# Altium project QCopterFC.PrjPCB
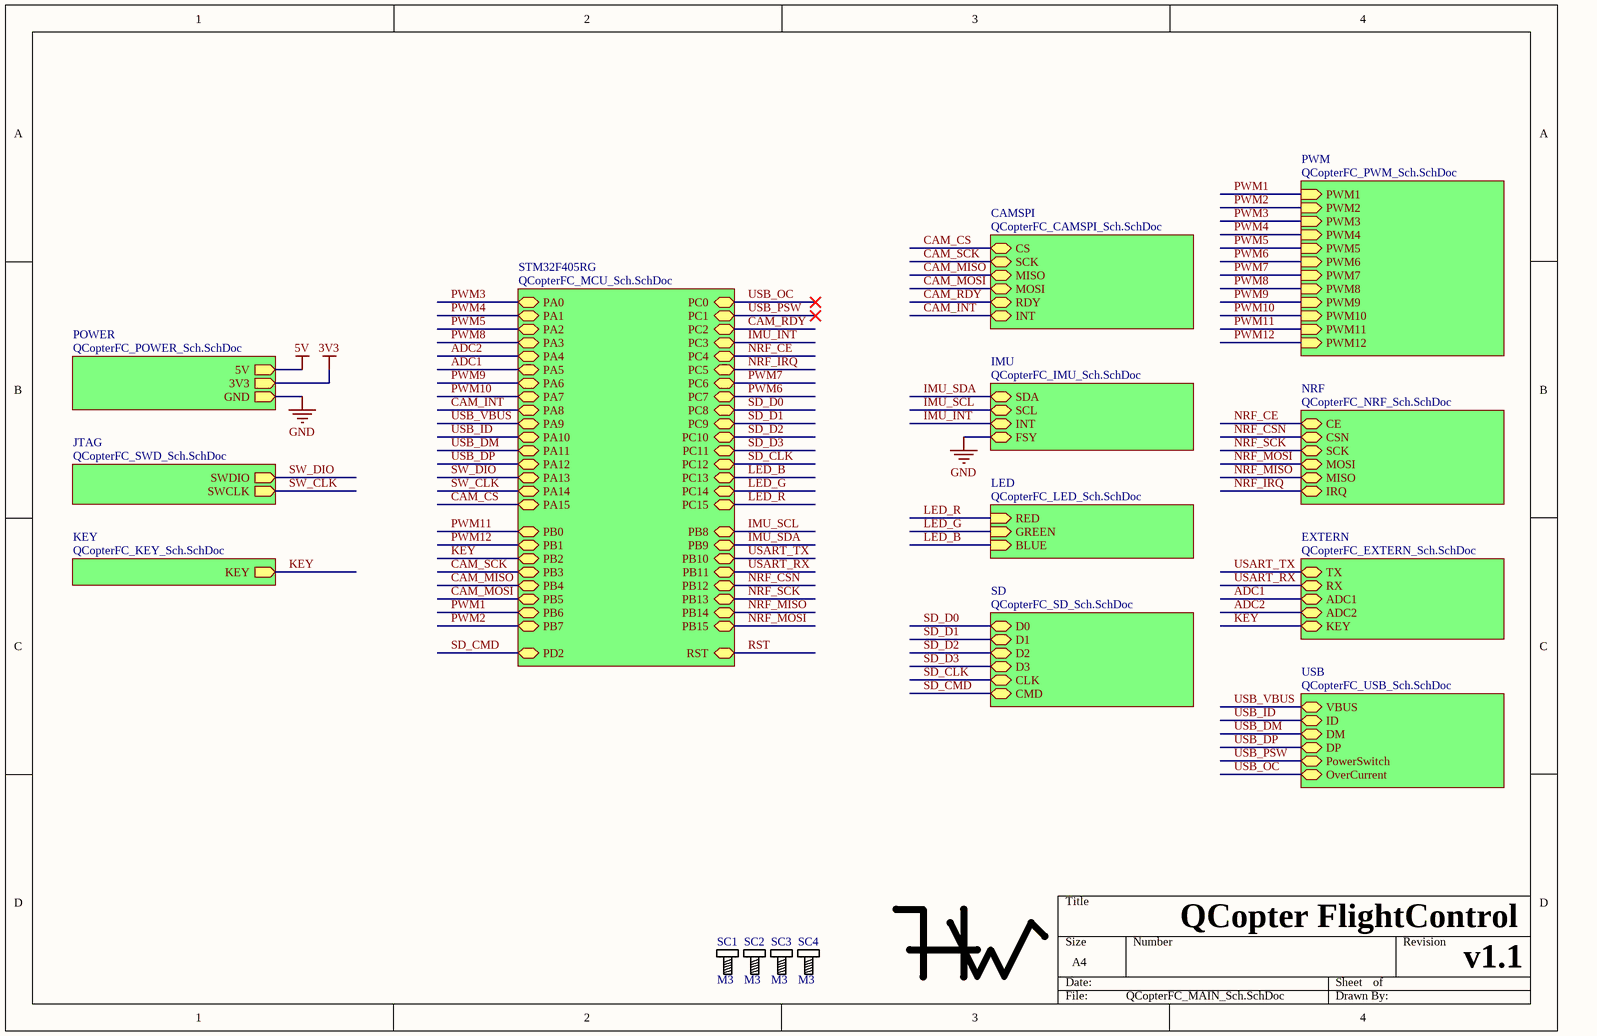
[diagram p0: QCopterFC_MAIN_Sch.SchDoc]
10 sheets, 47 parts. Net scope: hierarchical (ports join the sheet entries above them; power ports are global).
Board file: QCopterFC__Pcb.PcbDoc
Sheets:
  QCopterFC_MAIN_Sch.SchDoc
    CAMSPI = QCopterFC_CAMSPI_Sch.SchDoc
    NRF = QCopterFC_NRF_Sch.SchDoc
    JTAG = QCopterFC_SWD_Sch.SchDoc
    KEY = QCopterFC_KEY_Sch.SchDoc
    PWM = QCopterFC_PWM_Sch.SchDoc
    STM32F405RG = QCopterFC_MCU_Sch.SchDoc
    SD = QCopterFC_SD_Sch.SchDoc
    EXTERN = QCopterFC_EXTERN_Sch.SchDoc
    USB = QCopterFC_USB_Sch.SchDoc

## Sheet QCopterFC_MAIN_Sch.SchDoc
size A4

### Parts
Mark1  Mark  [HW_Mark]  (value not drawn)
SC1  M3  [SCRREW_M3]
SC2  M3  [SCRREW_M3]
SC3  M3  [SCRREW_M3]
SC4  M3  [SCRREW_M3]

### Sub-sheets
CAMSPI = QCopterFC_CAMSPI_Sch.SchDoc: MISO, CS, MOSI, SCK, RDY, INT
EXTERN = QCopterFC_EXTERN_Sch.SchDoc: ADC1, ADC2, TX, RX, KEY
IMU = QCopterFC_IMU_Sch.SchDoc (file not in this document): SCL, SDA, FSY, INT
JTAG = QCopterFC_SWD_Sch.SchDoc: SWDIO (out), SWCLK (out)
KEY = QCopterFC_KEY_Sch.SchDoc: KEY (out)
LED = QCopterFC_LED_Sch.SchDoc (file not in this document): RED (in), GREEN (in), BLUE (in)
NRF = QCopterFC_NRF_Sch.SchDoc: MISO, MOSI, SCK, CSN, CE, IRQ
POWER = QCopterFC_POWER_Sch.SchDoc (file not in this document): 3V3 (out), 5V (out), GND (out)
PWM = QCopterFC_PWM_Sch.SchDoc: PWM1 (in), PWM2 (in), PWM3 (in), PWM4 (in), PWM5 (in), PWM6 (in), PWM7 (in), PWM8 (in), PWM9 (in), PWM10 (in), PWM11 (in), PWM12 (in)
SD = QCopterFC_SD_Sch.SchDoc: D0, CLK, CMD, D1, D2, D3
STM32F405RG = QCopterFC_MCU_Sch.SchDoc: PA0, PA1, PA2, PA3, PA4, PA5, PA6, PA7, PA8, PA9, PA10, PA11, PA12, PA13, PA14, PA15, PB0, PB1, PB2, PB3, PB4, PB5, PB6, PB7, PB8, PB9, PB10, PB11, PB12, PB13, PB14, PB15, PC0, PC1, PC2, PC3, PC4, PC5, PC6, PC7, PC8, PC9, PC10, PC11, PC12, PC13, PC14, PC15, PD2, RST
USB = QCopterFC_USB_Sch.SchDoc: VBUS, ID, DM, DP, PowerSwitch, OverCurrent

### Nets
5V: sheet POWER/5V
GND: sheet IMU/FSY, sheet POWER/GND
ADC1: sheet STM32F405RG/PA5, sheet EXTERN/ADC1
ADC2: sheet STM32F405RG/PA4, sheet EXTERN/ADC2
CAM_CS: sheet CAMSPI/CS, sheet STM32F405RG/PA15
CAM_INT: sheet CAMSPI/INT, sheet STM32F405RG/PA8
CAM_MISO: sheet CAMSPI/MISO, sheet STM32F405RG/PB4
CAM_MOSI: sheet CAMSPI/MOSI, sheet STM32F405RG/PB5
CAM_RDY: sheet CAMSPI/RDY, sheet STM32F405RG/PC2
CAM_SCK: sheet CAMSPI/SCK, sheet STM32F405RG/PB3
IMU_INT: sheet IMU/INT, sheet STM32F405RG/PC3
IMU_SCL: sheet IMU/SCL, sheet STM32F405RG/PB8
IMU_SDA: sheet IMU/SDA, sheet STM32F405RG/PB9
KEY: sheet KEY/KEY, sheet STM32F405RG/PB2, sheet EXTERN/KEY
LED_B: sheet LED/BLUE, sheet STM32F405RG/PC13
LED_G: sheet LED/GREEN, sheet STM32F405RG/PC14
LED_R: sheet LED/RED, sheet STM32F405RG/PC15
NRF_CE: sheet NRF/CE, sheet STM32F405RG/PC4
NRF_CSN: sheet NRF/CSN, sheet STM32F405RG/PB12
NRF_IRQ: sheet NRF/IRQ, sheet STM32F405RG/PC5
NRF_MISO: sheet NRF/MISO, sheet STM32F405RG/PB14
NRF_MOSI: sheet NRF/MOSI, sheet STM32F405RG/PB15
NRF_SCK: sheet NRF/SCK, sheet STM32F405RG/PB13
PWM1: sheet PWM/PWM1, sheet STM32F405RG/PB6
PWM2: sheet PWM/PWM2, sheet STM32F405RG/PB7
PWM3: sheet PWM/PWM3, sheet STM32F405RG/PA0
PWM4: sheet PWM/PWM4, sheet STM32F405RG/PA1
PWM5: sheet PWM/PWM5, sheet STM32F405RG/PA2
PWM6: sheet PWM/PWM6, sheet STM32F405RG/PC7
PWM7: sheet PWM/PWM7, sheet STM32F405RG/PC6
PWM8: sheet PWM/PWM8, sheet STM32F405RG/PA3
PWM9: sheet PWM/PWM9, sheet STM32F405RG/PA6
PWM10: sheet PWM/PWM10, sheet STM32F405RG/PA7
PWM11: sheet PWM/PWM11, sheet STM32F405RG/PB0
PWM12: sheet PWM/PWM12, sheet STM32F405RG/PB1
SD_CLK: sheet STM32F405RG/PC12, sheet SD/CLK
SD_CMD: sheet STM32F405RG/PD2, sheet SD/CMD
SD_D0: sheet STM32F405RG/PC8, sheet SD/D0
SD_D1: sheet STM32F405RG/PC9, sheet SD/D1
SD_D2: sheet STM32F405RG/PC10, sheet SD/D2
SD_D3: sheet STM32F405RG/PC11, sheet SD/D3
SW_CLK: sheet JTAG/SWCLK, sheet STM32F405RG/PA14
SW_DIO: sheet JTAG/SWDIO, sheet STM32F405RG/PA13
USART_RX: sheet STM32F405RG/PB11, sheet EXTERN/RX
USART_TX: sheet STM32F405RG/PB10, sheet EXTERN/TX
USB_DM: sheet STM32F405RG/PA11, sheet USB/DM
USB_DP: sheet STM32F405RG/PA12, sheet USB/DP
USB_ID: sheet STM32F405RG/PA10, sheet USB/ID
USB_OC: sheet STM32F405RG/PC0, sheet USB/OverCurrent
USB_PSW: sheet STM32F405RG/PC1, sheet USB/PowerSwitch
USB_VBUS: sheet STM32F405RG/PA9, sheet USB/VBUS

### Notes on the sheet
- QCopter FlightControl
- v1.1

### Library data of the parts
Mark1 = HW
SC1-SC4 = Screw_M3: Screw

## Sheet QCopterFC_CAMSPI_Sch.SchDoc
size A4
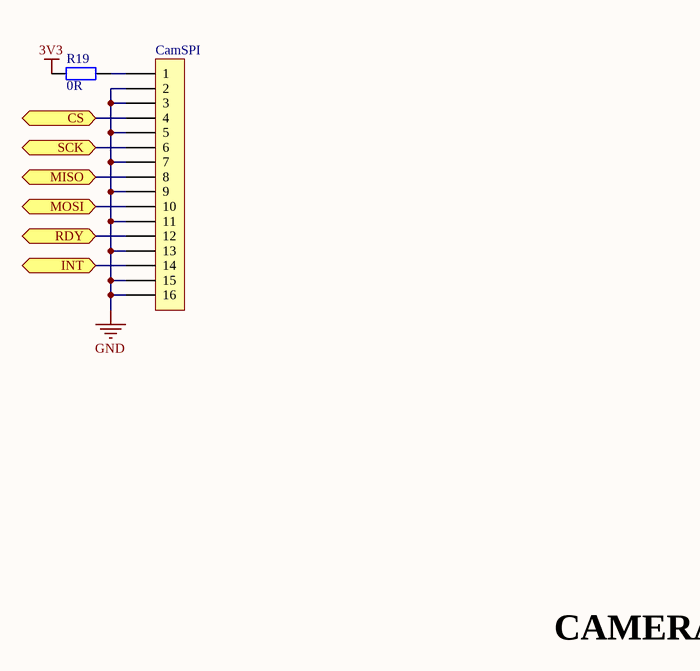
[diagram p1: QCopterFC_CAMSPI_Sch.SchDoc]

### Parts
CamSPI  FFC_0.5_16  [FFC_0.5_16]  (value not drawn)
R19  value 0R  [RES_0603]  (hidden comment: Res_0603)

### Ports
CS, INT, MISO, MOSI, RDY, SCK

### Nets
3V3: R19.1
GND: CamSPI.2 CamSPI.3 CamSPI.5 CamSPI.7 CamSPI.9 CamSPI.11 CamSPI.13 CamSPI.15 CamSPI.16
CAM_CS: CamSPI.4 ; port CS
CAM_INT: CamSPI.14 ; port INT
CAM_MISO: CamSPI.8 ; port MISO
CAM_MOSI: CamSPI.10 ; port MOSI
CAM_RDY: CamSPI.12 ; port RDY
CAM_SCK: CamSPI.6 ; port SCK
NetCamSPI_1: CamSPI.1 R19.2

### Notes on the sheet
- CAMERA

### Library data of the parts
CamSPI = FFC_0.5_16: FFC
R19 = Res_0603: Resistor

## Sheet QCopterFC_NRF_Sch.SchDoc
size A4
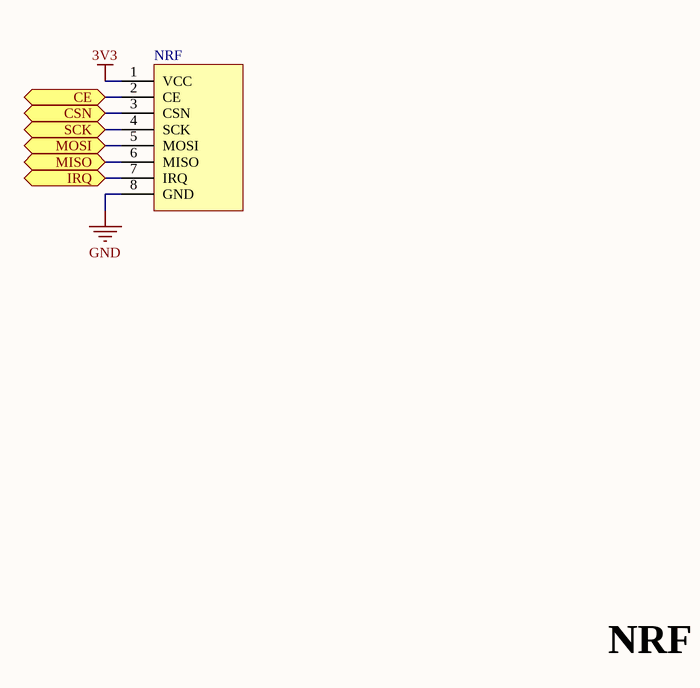
[diagram p2: QCopterFC_NRF_Sch.SchDoc]

### Parts
NRF  nRF24L01P_PA_LNA  [NRF24L01P_PA_LNA]  (value not drawn)

### Ports
CE, CSN, IRQ, MISO, MOSI, SCK

### Nets
3V3: NRF.1(VCC)
GND: NRF.8(GND)
NRF_CE: NRF.2(CE) ; port CE
NRF_CSN: NRF.3(CSN) ; port CSN
NRF_IRQ: NRF.7(IRQ) ; port IRQ
NRF_MISO: NRF.6(MISO) ; port MISO
NRF_MOSI: NRF.5(MOSI) ; port MOSI
NRF_SCK: NRF.4(SCK) ; port SCK

### Notes on the sheet
- NRF

### Library data of the parts
NRF = nRF24L01P_PA_LNA: Module

## Sheet QCopterFC_SWD_Sch.SchDoc
size A4
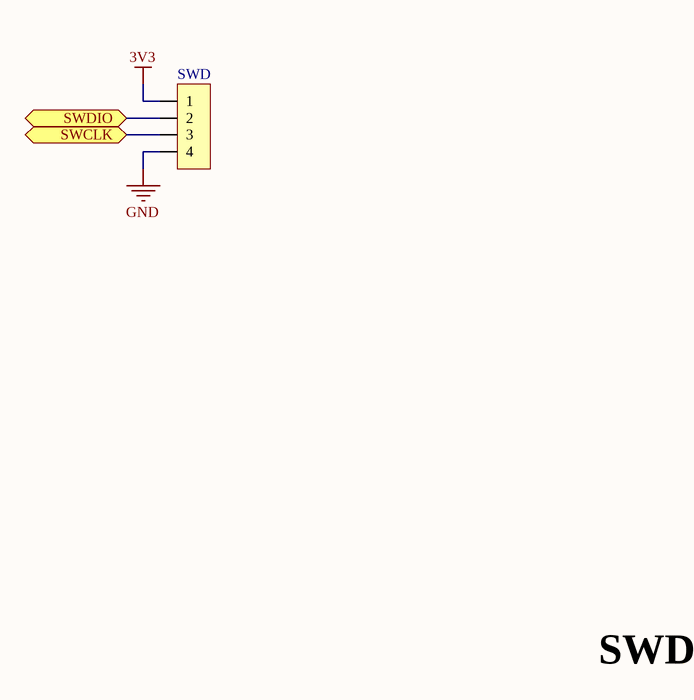
[diagram p3: QCopterFC_SWD_Sch.SchDoc]

### Parts
SWD  HDR1X4_90F_2.54  [HDR1X4_90F_2.54]  (value not drawn)

### Ports
SWCLK, SWDIO

### Nets
3V3: SWD.1
GND: SWD.4
SW_CLK: SWD.3 ; port SWCLK
SW_DIO: SWD.2 ; port SWDIO

### Notes on the sheet
- SWD

### Library data of the parts
SWD = HDR1X4_90F_2.54: Header

## Sheet QCopterFC_KEY_Sch.SchDoc
size A4
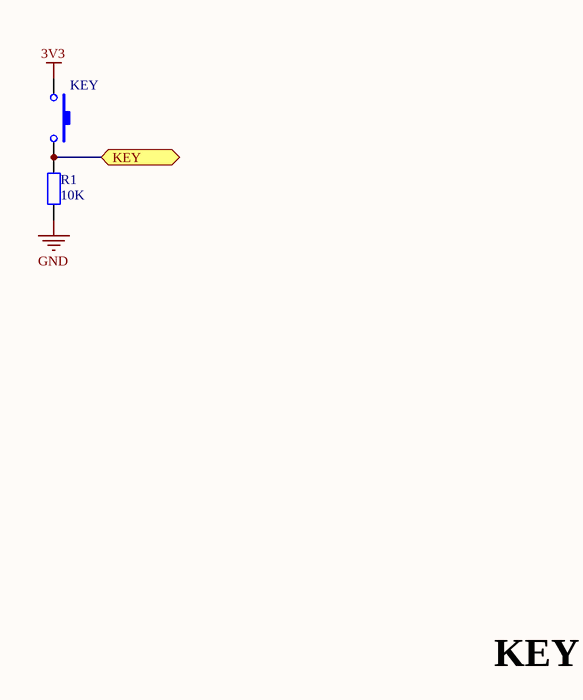
[diagram p4: QCopterFC_KEY_Sch.SchDoc]

### Parts
KEY  SW-PB_1  [BT_90_T]  (value not drawn)
R1  value 10K  [RES_0603]  (hidden comment: Res_0603)

### Ports
KEY

### Nets
3V3: KEY.1
GND: R1.1
KEY: KEY.2 R1.2 ; port KEY

### Notes on the sheet
- KEY

### Library data of the parts
KEY = SW-PB_1: Switch; Published: 24-Mar-1999; LatestRevisionDate: 17-Jul-2002; LatestRevisionNote: Re-released for DXP Platform.; PackageReference: SPST-2; Publisher: Altium Limited; PackageDescription: Switch; 2 Leads
R1 = Res_0603: Resistor

## Sheet QCopterFC_PWM_Sch.SchDoc
size A4
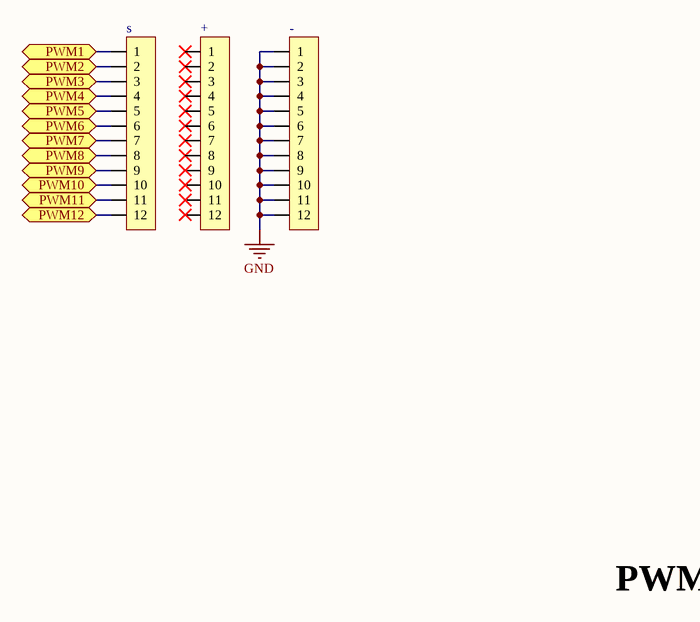
[diagram p5: QCopterFC_PWM_Sch.SchDoc]

### Parts
+  HDR1X12_180_2.54  [HDR1X12_180_2.54]  (value not drawn)
-  HDR1X12_180_2.54  [HDR1X12_180_2.54]  (value not drawn)
s  HDR1X12_180_2.54  [HDR1X12_180_2.54]  (value not drawn)

### Ports
PWM1, PWM2, PWM3, PWM4, PWM5, PWM6, PWM7, PWM8, PWM9, PWM10, PWM11, PWM12

### Nets
GND: -.1 -.2 -.3 -.4 -.5 -.6 -.7 -.8 -.9 -.10 -.11 -.12
PWM1: s.1 ; port PWM1
PWM2: s.2 ; port PWM2
PWM3: s.3 ; port PWM3
PWM4: s.4 ; port PWM4
PWM5: s.5 ; port PWM5
PWM6: s.6 ; port PWM6
PWM7: s.7 ; port PWM7
PWM8: s.8 ; port PWM8
PWM9: s.9 ; port PWM9
PWM10: s.10 ; port PWM10
PWM11: s.11 ; port PWM11
PWM12: s.12 ; port PWM12

Not connected (* = marked no-connect by the designer): + 1* 2* 3* 4* 5* 6* 7* 8* 9* 10* 11* 12*

### Notes on the sheet
- PWM

### Library data of the parts
+ - s = HDR1X12_180_2.54: Header

## Sheet QCopterFC_MCU_Sch.SchDoc
size A4
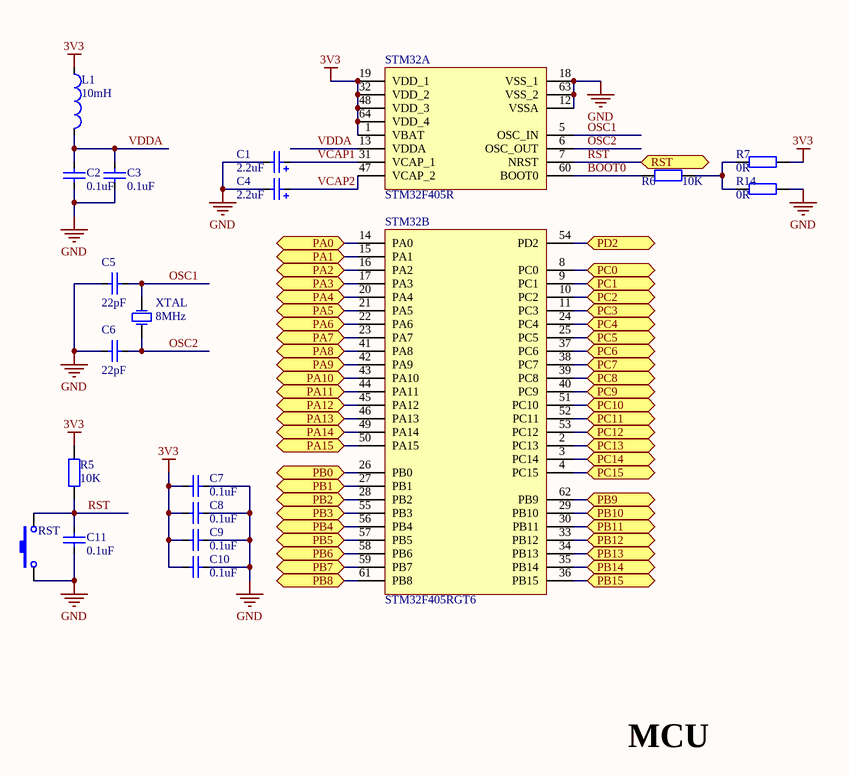
[diagram p6: QCopterFC_MCU_Sch.SchDoc]

### Parts
C1  value 2.2uF  [CAP_TAN_P0805]  (hidden comment: Cap_Tan_0805)
C2  value 0.1uF  [CAP_0603]  (hidden comment: Cap_0603)
C3  value 0.1uF  [CAP_0603]  (hidden comment: Cap_0603)
C4  value 2.2uF  [CAP_TAN_P0805]  (hidden comment: Cap_Tan_0805)
C5  value 22pF  [CAP_0603]  (hidden comment: Cap_0603)
C6  value 22pF  [CAP_0603]  (hidden comment: Cap_0603)
C7  value 0.1uF  [CAP_0603]  (hidden comment: Cap_0603)
C8  value 0.1uF  [CAP_0603]  (hidden comment: Cap_0603)
C9  value 0.1uF  [CAP_0603]  (hidden comment: Cap_0603)
C10  value 0.1uF  [CAP_0603]  (hidden comment: Cap_0603)
C11  value 0.1uF  [CAP_0603]  (hidden comment: Cap_0603)
L1  value 10mH  [IND_0603]  (hidden comment: Ind_0603)
R5  value 10K  [RES_0603]  (hidden comment: Res_0603)
R6  value 10K  [RES_0603]  (hidden comment: Res_0603)
R7  value 0R  [RES_0603]  (hidden comment: Res_0603)
R14  value 0R  [RES_0603]  (hidden comment: Res_0603)
RST  SW-PB_1  [BT_90_T]  (value not drawn)
STM32  STM32F405R  [STM32F_64]  (parts A,B of 2)
XTAL  value 8MHz  [XTAL_5032]  (hidden comment: XTAL_5032)

### Ports
PA0, PA1, PA2, PA3, PA4, PA5, PA6, PA7, PA8, PA9, PA10, PA11, PA12, PA13, PA14, PA15, PB0, PB1, PB2, PB3, PB4, PB5, PB6, PB7, PB8, PB9, PB10, PB11, PB12, PB13, PB14, PB15, PC0, PC1, PC2, PC3, PC4, PC5, PC6, PC7, PC8, PC9, PC10, PC11, PC12, PC13, PC14, PC15, PD2, RST

### Nets
3V3: C7.2 C8.2 C9.2 C10.2 L1.1 R5.1 R7.2 STM32.1(VBAT) STM32.19(VDD_1) STM32.32(VDD_2) STM32.48(VDD_3) STM32.64(VDD_4)
GND: C1.2 C2.2 C3.2 C4.2 C5.1 C6.1 C7.1 C8.1 C9.1 C10.1 C11.2 R14.2 RST.1 STM32.12(VSSA) STM32.18(VSS_1) STM32.63(VSS_2)
ADC1: STM32.21(PA5) ; port PA5
ADC2: STM32.20(PA4) ; port PA4
BOOT0: R6.1 STM32.60(BOOT0)
CAM_CS: STM32.50(PA15) ; port PA15
CAM_INT: STM32.41(PA8) ; port PA8
CAM_MISO: STM32.56(PB4) ; port PB4
CAM_MOSI: STM32.57(PB5) ; port PB5
CAM_RDY: STM32.10(PC2) ; port PC2
CAM_SCK: STM32.55(PB3) ; port PB3
IMU_INT: STM32.11(PC3) ; port PC3
IMU_SCL: STM32.61(PB8) ; port PB8
IMU_SDA: STM32.62(PB9) ; port PB9
KEY: STM32.28(PB2) ; port PB2
LED_B: STM32.2(PC13) ; port PC13
LED_G: STM32.3(PC14) ; port PC14
LED_R: STM32.4(PC15) ; port PC15
NRF_CE: STM32.24(PC4) ; port PC4
NRF_CSN: STM32.33(PB12) ; port PB12
NRF_IRQ: STM32.25(PC5) ; port PC5
NRF_MISO: STM32.35(PB14) ; port PB14
NRF_MOSI: STM32.36(PB15) ; port PB15
NRF_SCK: STM32.34(PB13) ; port PB13
OSC1: C5.2 STM32.5(OSC_IN) XTAL.2(OSC2)
OSC2: C6.2 STM32.6(OSC_OUT) XTAL.1(OSC1)
PWM1: STM32.58(PB6) ; port PB6
PWM2: STM32.59(PB7) ; port PB7
PWM3: STM32.14(PA0) ; port PA0
PWM4: STM32.15(PA1) ; port PA1
PWM5: STM32.16(PA2) ; port PA2
PWM6: STM32.38(PC7) ; port PC7
PWM7: STM32.37(PC6) ; port PC6
PWM8: STM32.17(PA3) ; port PA3
PWM9: STM32.22(PA6) ; port PA6
PWM10: STM32.23(PA7) ; port PA7
PWM11: STM32.26(PB0) ; port PB0
PWM12: STM32.27(PB1) ; port PB1
RST: C11.1 R5.2 RST.2 STM32.7(NRST) ; port RST
SD_CLK: STM32.53(PC12) ; port PC12
SD_CMD: STM32.54(PD2) ; port PD2
SD_D0: STM32.39(PC8) ; port PC8
SD_D1: STM32.40(PC9) ; port PC9
SD_D2: STM32.51(PC10) ; port PC10
SD_D3: STM32.52(PC11) ; port PC11
SW_CLK: STM32.49(PA14) ; port PA14
SW_DIO: STM32.46(PA13) ; port PA13
USART_RX: STM32.30(PB11) ; port PB11
USART_TX: STM32.29(PB10) ; port PB10
USB_DM: STM32.44(PA11) ; port PA11
USB_DP: STM32.45(PA12) ; port PA12
USB_ID: STM32.43(PA10) ; port PA10
USB_OC: STM32.8(PC0) ; port PC0
USB_PSW: STM32.9(PC1) ; port PC1
USB_VBUS: STM32.42(PA9) ; port PA9
VCAP1: C1.1 STM32.31(VCAP_1)
VCAP2: C4.1 STM32.47(VCAP_2)
VDDA: C2.1 C3.1 L1.2 STM32.13(VDDA)
NetR6_2: R6.2 R7.1 R14.1

### Notes on the sheet
- MCU

### Library data of the parts
C1 C4 = Cap_Tan_0805: Capacitor
C2 C3 C5-C11 = Cap_0603: Capacitor
L1 = Ind_0603: Inductor
R5-R7 R14 = Res_0603: Resistor
RST = SW-PB_1: Switch; Published: 24-Mar-1999; LatestRevisionDate: 17-Jul-2002; LatestRevisionNote: Re-released for DXP Platform.; PackageReference: SPST-2; Publisher: Altium Limited; PackageDescription: Switch; 2 Leads
STM32 = STM32F405R: MCU
XTAL = XTAL_5032: Crystal Oscillator; Published: 8-Jun-2000; LatestRevisionDate: 17-Jul-2002; LatestRevisionNote: Re-released for DXP Platform.; PackageReference: R38; Publisher: Altium Limited; PackageDescription: Crystal, Thru-Hole; 2 Leads; Body 3.1 x 8.2 mm (Dia.xH)

## Sheet QCopterFC_SD_Sch.SchDoc
size A4
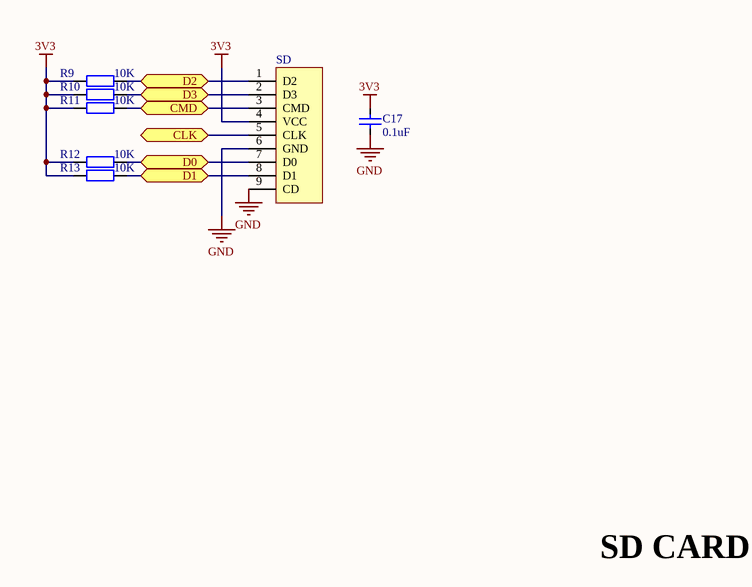
[diagram p7: QCopterFC_SD_Sch.SchDoc]

### Parts
C17  value 0.1uF  [CAP_0603]  (hidden comment: Cap_0603)
R9  value 10K  [RES_0603]  (hidden comment: Res_0603)
R10  value 10K  [RES_0603]  (hidden comment: Res_0603)
R11  value 10K  [RES_0603]  (hidden comment: Res_0603)
R12  value 10K  [RES_0603]  (hidden comment: Res_0603)
R13  value 10K  [RES_0603]  (hidden comment: Res_0603)
SD  SD_Card_TF  [SD_Card_TF]  (value not drawn)

### Ports
CLK, CMD, D0, D1, D2, D3

### Nets
3V3: C17.2 R9.1 R10.1 R11.1 R12.1 R13.1 SD.4(VCC)
GND: C17.1 SD.6(GND) SD.9(CD)
SD_CLK: SD.5(CLK) ; port CLK
SD_CMD: R11.2 SD.3(CMD) ; port CMD
SD_D0: R12.2 SD.7(D0) ; port D0
SD_D1: R13.2 SD.8(D1) ; port D1
SD_D2: R9.2 SD.1(D2) ; port D2
SD_D3: R10.2 SD.2(D3) ; port D3

### Notes on the sheet
- Labels drawn without touching a wire or pin: SD CARD

### Library data of the parts
C17 = Cap_0603: Capacitor
R9-R13 = Res_0603: Resistor
SD = SD_Card_TF: SD

## Sheet QCopterFC_EXTERN_Sch.SchDoc
size A4
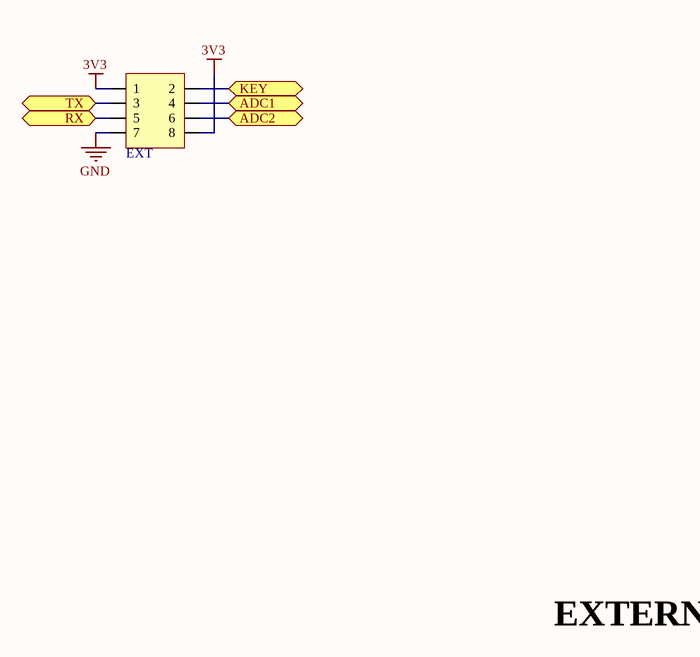
[diagram p8: QCopterFC_EXTERN_Sch.SchDoc]

### Parts
EXT  HDR2X4_90_2.54  [HDR2X4_90_2.54]  (value not drawn)

### Ports
ADC1, ADC2, KEY, RX, TX

### Nets
3V3: EXT.1 EXT.8
GND: EXT.7
ADC1: EXT.4 ; port ADC1
ADC2: EXT.6 ; port ADC2
KEY: EXT.2 ; port KEY
USART_RX: EXT.5 ; port RX
USART_TX: EXT.3 ; port TX

### Notes on the sheet
- Labels drawn without touching a wire or pin: EXTERN

### Library data of the parts
EXT = HDR2X4_90_2.54: Header

## Sheet QCopterFC_USB_Sch.SchDoc
size A4
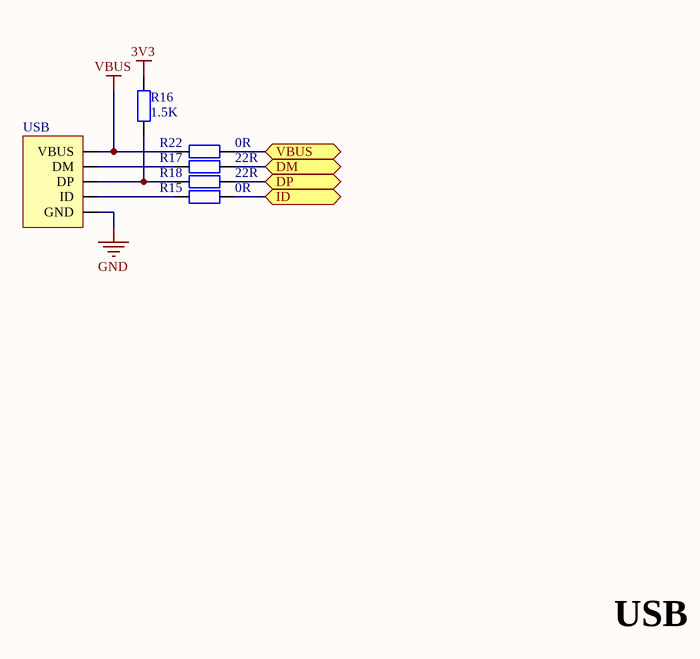
[diagram p9: QCopterFC_USB_Sch.SchDoc]

### Parts
R15  value 0R  [RES_0603]  (hidden comment: Res_0603)
R16  value 1.5K  [RES_0603]  (hidden comment: Res_0603)
R17  value 22R  [RES_0603]  (hidden comment: Res_0603)
R18  value 22R  [RES_0603]  (hidden comment: Res_0603)
R22  value 0R  [RES_0603]  (hidden comment: Res_0603)
USB  USB_Micro  [USB_MICRO_B]  (value not drawn)

### Ports
DM, DP, ID, VBUS

### Nets
3V3: R16.2
GND: USB.5(GND)
VBUS: R22.1 USB.1(VBUS)
USB_DM: R17.2 ; port DM
USB_DP: R18.2 ; port DP
USB_ID: R15.2 ; port ID
USB_VBUS: R22.2 ; port VBUS
NetR15_1: R15.1 USB.4(ID)
NetR16_1: R16.1 R18.1 USB.3(DP)
NetR17_1: R17.1 USB.2(DM)

### Notes on the sheet
- USB

### Library data of the parts
R15-R18 R22 = Res_0603: Resistor
USB = USB_Micro: USB

## Nets that join several sheets
3V3: QCopterFC_CAMSPI_Sch (R19.1), QCopterFC_NRF_Sch (NRF.1), QCopterFC_SWD_Sch (SWD.1), QCopterFC_KEY_Sch (KEY.1), QCopterFC_MCU_Sch (12 pins), QCopterFC_SD_Sch (7 pins), QCopterFC_EXTERN_Sch (EXT.1 EXT.8), QCopterFC_USB_Sch (R16.2)
GND: QCopterFC_CAMSPI_Sch (9 pins), QCopterFC_NRF_Sch (NRF.8), QCopterFC_SWD_Sch (SWD.4), QCopterFC_KEY_Sch (R1.1), QCopterFC_PWM_Sch (12 pins), QCopterFC_MCU_Sch (16 pins), QCopterFC_SD_Sch (C17.1 SD.6 SD.9), QCopterFC_EXTERN_Sch (EXT.7), QCopterFC_USB_Sch (USB.5)
ADC1: QCopterFC_MCU_Sch (STM32.21), QCopterFC_EXTERN_Sch (EXT.4)
ADC2: QCopterFC_MCU_Sch (STM32.20), QCopterFC_EXTERN_Sch (EXT.6)
CAM_CS: QCopterFC_CAMSPI_Sch (CamSPI.4), QCopterFC_MCU_Sch (STM32.50)
CAM_INT: QCopterFC_CAMSPI_Sch (CamSPI.14), QCopterFC_MCU_Sch (STM32.41)
CAM_MISO: QCopterFC_CAMSPI_Sch (CamSPI.8), QCopterFC_MCU_Sch (STM32.56)
CAM_MOSI: QCopterFC_CAMSPI_Sch (CamSPI.10), QCopterFC_MCU_Sch (STM32.57)
CAM_RDY: QCopterFC_CAMSPI_Sch (CamSPI.12), QCopterFC_MCU_Sch (STM32.10)
CAM_SCK: QCopterFC_CAMSPI_Sch (CamSPI.6), QCopterFC_MCU_Sch (STM32.55)
KEY: QCopterFC_KEY_Sch (KEY.2 R1.2), QCopterFC_MCU_Sch (STM32.28), QCopterFC_EXTERN_Sch (EXT.2)
NRF_CE: QCopterFC_NRF_Sch (NRF.2), QCopterFC_MCU_Sch (STM32.24)
NRF_CSN: QCopterFC_NRF_Sch (NRF.3), QCopterFC_MCU_Sch (STM32.33)
NRF_IRQ: QCopterFC_NRF_Sch (NRF.7), QCopterFC_MCU_Sch (STM32.25)
NRF_MISO: QCopterFC_NRF_Sch (NRF.6), QCopterFC_MCU_Sch (STM32.35)
NRF_MOSI: QCopterFC_NRF_Sch (NRF.5), QCopterFC_MCU_Sch (STM32.36)
NRF_SCK: QCopterFC_NRF_Sch (NRF.4), QCopterFC_MCU_Sch (STM32.34)
PWM1: QCopterFC_PWM_Sch (s.1), QCopterFC_MCU_Sch (STM32.58)
PWM2: QCopterFC_PWM_Sch (s.2), QCopterFC_MCU_Sch (STM32.59)
PWM3: QCopterFC_PWM_Sch (s.3), QCopterFC_MCU_Sch (STM32.14)
PWM4: QCopterFC_PWM_Sch (s.4), QCopterFC_MCU_Sch (STM32.15)
PWM5: QCopterFC_PWM_Sch (s.5), QCopterFC_MCU_Sch (STM32.16)
PWM6: QCopterFC_PWM_Sch (s.6), QCopterFC_MCU_Sch (STM32.38)
PWM7: QCopterFC_PWM_Sch (s.7), QCopterFC_MCU_Sch (STM32.37)
PWM8: QCopterFC_PWM_Sch (s.8), QCopterFC_MCU_Sch (STM32.17)
PWM9: QCopterFC_PWM_Sch (s.9), QCopterFC_MCU_Sch (STM32.22)
PWM10: QCopterFC_PWM_Sch (s.10), QCopterFC_MCU_Sch (STM32.23)
PWM11: QCopterFC_PWM_Sch (s.11), QCopterFC_MCU_Sch (STM32.26)
PWM12: QCopterFC_PWM_Sch (s.12), QCopterFC_MCU_Sch (STM32.27)
SD_CLK: QCopterFC_MCU_Sch (STM32.53), QCopterFC_SD_Sch (SD.5)
SD_CMD: QCopterFC_MCU_Sch (STM32.54), QCopterFC_SD_Sch (R11.2 SD.3)
SD_D0: QCopterFC_MCU_Sch (STM32.39), QCopterFC_SD_Sch (R12.2 SD.7)
SD_D1: QCopterFC_MCU_Sch (STM32.40), QCopterFC_SD_Sch (R13.2 SD.8)
SD_D2: QCopterFC_MCU_Sch (STM32.51), QCopterFC_SD_Sch (R9.2 SD.1)
SD_D3: QCopterFC_MCU_Sch (STM32.52), QCopterFC_SD_Sch (R10.2 SD.2)
SW_CLK: QCopterFC_SWD_Sch (SWD.3), QCopterFC_MCU_Sch (STM32.49)
SW_DIO: QCopterFC_SWD_Sch (SWD.2), QCopterFC_MCU_Sch (STM32.46)
USART_RX: QCopterFC_MCU_Sch (STM32.30), QCopterFC_EXTERN_Sch (EXT.5)
USART_TX: QCopterFC_MCU_Sch (STM32.29), QCopterFC_EXTERN_Sch (EXT.3)
USB_DM: QCopterFC_MCU_Sch (STM32.44), QCopterFC_USB_Sch (R17.2)
USB_DP: QCopterFC_MCU_Sch (STM32.45), QCopterFC_USB_Sch (R18.2)
USB_ID: QCopterFC_MCU_Sch (STM32.43), QCopterFC_USB_Sch (R15.2)
USB_VBUS: QCopterFC_MCU_Sch (STM32.42), QCopterFC_USB_Sch (R22.2)